# EAGLE schematic Stepper Driver jig bottom (EAGLE 6.6.0)
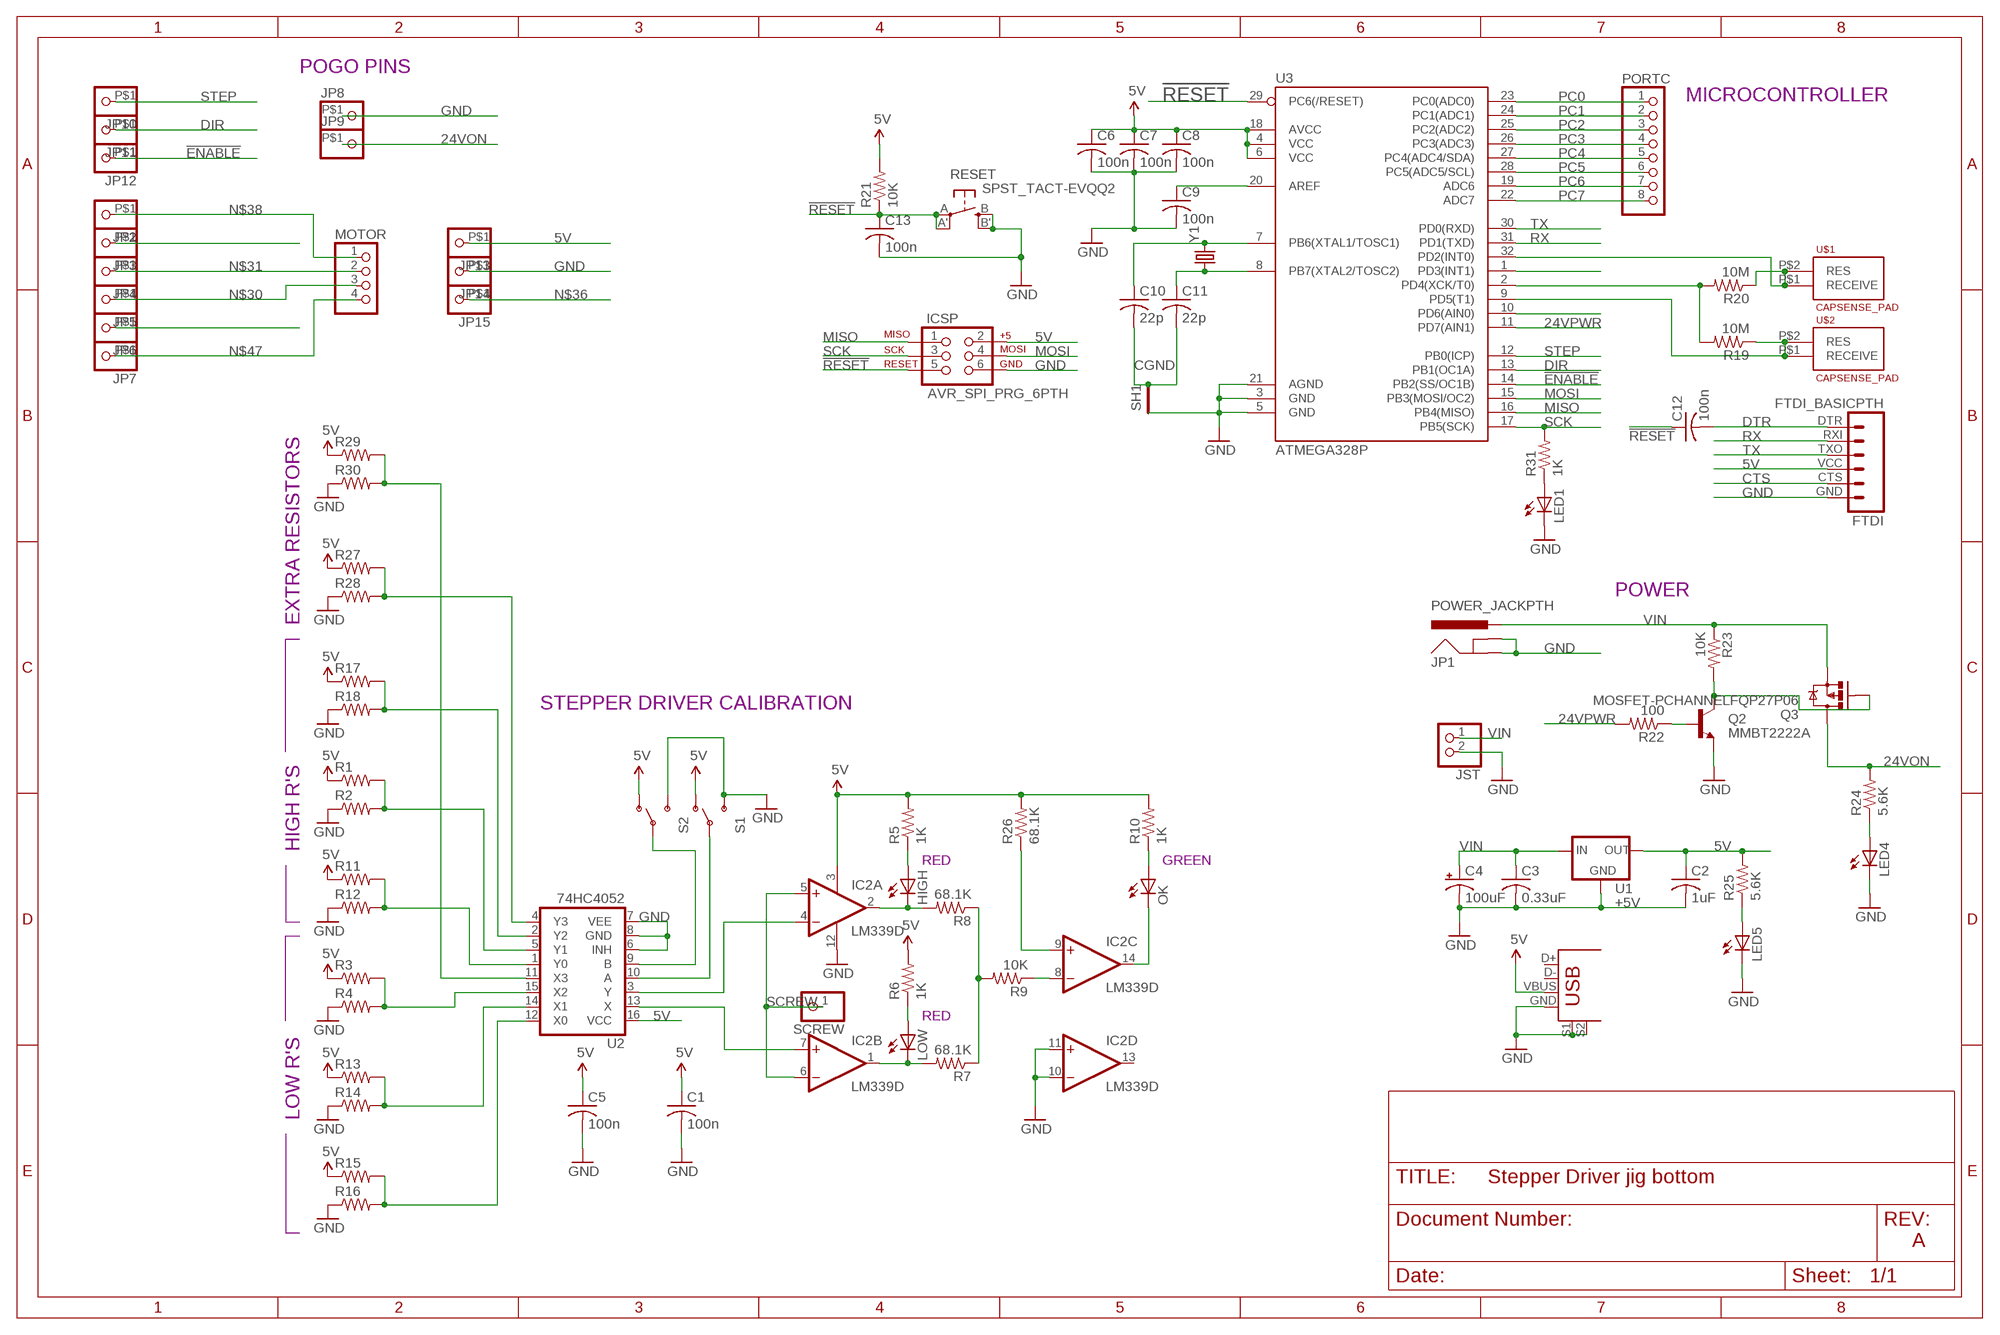
[diagram p0: schematic, sheet 1]

## Parts
C1  100n  C-USC0805  [C0805]
C2  1uF  C-USC0805  [C0805]
C3  0.33uF  C-USC0805  [C0805]
C4  100uF  CPOL-USUD-8X10  [UD-8X10_NICHICON]
C5  100n  C-USC0805  [C0805]
C6  100n  C-USC0805  [C0805]
C7  100n  C-USC0805  [C0805]
C8  100n  C-USC0805  [C0805]
C9  100n  C-USC0805  [C0805]
C10  22p  C-USC0805  [C0805]
C11  22p  C-USC0805  [C0805]
C12  100n  C-USC0805  [C0805]
C13  100n  C-USC0805  [C0805]
FTDI  FTDI_BASICPTH  [FTDI_BASIC]
HIGH  LEDCHIPLED_1206  [CHIPLED_1206]
IC2  LM339D  [SO14]
ICSP  AVR_SPI_PRG_6PTH  [2X3]
JP1  POWER_JACKPTH  [POWER_JACK_PTH]
JP2  PINHD-1X1  [POGOPIN]
JP3  PINHD-1X1  [POGOPIN]
JP4  PINHD-1X1  [POGOPIN]
JP5  PINHD-1X1  [POGOPIN]
JP6  PINHD-1X1  [POGOPIN]
JP7  PINHD-1X1  [POGOPIN]
JP8  PINHD-1X1  [POGOPIN]
JP9  PINHD-1X1  [POGOPIN]
JP10  PINHD-1X1  [POGOPIN]
JP11  PINHD-1X1  [POGOPIN]
JP12  PINHD-1X1  [POGOPIN]
JP13  PINHD-1X1  [POGOPIN]
JP14  PINHD-1X1  [POGOPIN]
JP15  PINHD-1X1  [POGOPIN]
JST  JST_2PIN-SMT-RA  [JST-PH-2-SMT-RA]
LED1  LEDCHIP-LED0805  [CHIP-LED0805]
LED4  LEDCHIPLED_0805  [CHIPLED_0805]
LED5  LEDCHIPLED_0805  [CHIPLED_0805]
LOW  LEDCHIPLED_1206  [CHIPLED_1206]
MOTOR  PINHD-1X4  [1X04]
OK  LEDCHIPLED_1206  [CHIPLED_1206]
PORTC  PINHD-1X8  [1X08]
Q2  MMBT2222A  TRANSISTOR_NPNMMBT2222A  [SOT23-3]
Q3  MOSFET-PCHANNELFQP27P06  [TO220V]
R1  R-US_M0805  [M0805]
R2  R-US_M0805  [M0805]
R3  R-US_M0805  [M0805]
R4  R-US_M0805  [M0805]
R5  1K  R-US_M0805  [M0805]
R6  1K  R-US_M0805  [M0805]
R7  68.1K  R-US_M0805  [M0805]
R8  68.1K  R-US_M0805  [M0805]
R9  10K  R-US_M0805  [M0805]
R10  1K  R-US_M0805  [M0805]
R11  R-US_M0805  [M0805]
R12  R-US_M0805  [M0805]
R13  R-US_M0805  [M0805]
R14  R-US_M0805  [M0805]
R15  R-US_M0805  [M0805]
R16  R-US_M0805  [M0805]
R17  R-US_M0805  [M0805]
R18  R-US_M0805  [M0805]
R19  10M  R-US_M0805  [M0805]
R20  10M  R-US_M0805  [M0805]
R21  10K  R-US_M0805  [M0805]
R22  100  R-US_M0805  [M0805]
R23  10K  R-US_M0805  [M0805]
R24  5.6K  R-US_M0805  [M0805]
R25  5.6K  R-US_M0805  [M0805]
R26  68.1K  R-US_M0805  [M0805]
R27  R-US_M0805  [M0805]
R28  R-US_M0805  [M0805]
R29  R-US_M0805  [M0805]
R30  R-US_M0805  [M0805]
R31  1K  R-US_M0805  [M0805]
RESET  SPST_TACT-EVQQ2  [EVQ-Q2]
S1  SWITCH-SPDTKIT  [SWITCH-SPDT_KIT]
S2  SWITCH-SPDTKIT  [SWITCH-SPDT_KIT]
SCREW  PINHD-1X1  [1X01]
SH1  SHORTT5  [SHORT_TOP-50]
U1  +5V  V_REG_78XX7812  [TO-252]
U2  74HC4052  74HC4052SO  [SO16]
U3  ATMEGA328P  ATMEGA328P_TQFP  [TQFP32-08]
U$1  CAPSENSE_PAD  [CAPSENSE_PAD]
U$2  CAPSENSE_PAD  [CAPSENSE_PAD]
U$3  USB+SHIELD  [USB-B-PTH]
Y1  CRYSTALHC49US  [HC49US]

## Nets
5V: C1.1 C2.1 C5.1 C6.1 C7.1 C8.1 FTDI.VCC IC2.3(P:V+) ICSP.2 JP13.P$1 R1.1 R3.1 R5.2 R6.2 R10.2 R11.1 R13.1 R15.1 R17.1 R21.2 R25.2 R26.2 R27.1 R29.1 S1.1(O) S2.1(O) U1.2(OUT) U2.16(VCC) U3.4(VCC) U3.6(VCC) U3.18(AVCC) U$3.VBUS
24VON: JP9.P$1 Q3.2(D) R24.2
24VPWR: R22.2 U3.11(PD7(AIN1))
!ENABLE: JP12.P$1 U3.14(PB2(SS/OC1B))
!RESET: C12.1 C13.1 ICSP.5 R21.1 RESET.A'(P1) RESET.A(P) U3.29(PC6(/RESET))
CGND: C10.2 C11.2 SH1.2
CTS: FTDI.CTS
DIR: JP11.P$1 U3.13(PB1(OC1A))
DTR: C12.2 FTDI.DTR
GND: C1.2 C2.2 C3.2 C4.- C5.2 C6.2 C7.2 C8.2 C9.2 C13.2 FTDI.GND IC2.10(D:-IN) IC2.11(D:+IN) IC2.12(P:GND) ICSP.6 JP1.GND JP1.GNDBREAK JP8.P$1 JP14.P$1 JST.2 LED1.C LED4.C LED5.C Q2.2(E) R2.1 R4.1 R12.1 R14.1 R16.1 R18.1 R28.1 R30.1 RESET.B'(S1) RESET.B(S) S1.3(S) S2.3(S) SH1.1 U1.3(GND) U2.6(INH) U2.7(VEE) U2.8(GND) U3.3(GND) U3.5(GND) U3.21(AGND) U$3.GND U$3.S1 U$3.S2
MISO: ICSP.1 U3.16(PB4(MISO))
MOSI: ICSP.4 U3.15(PB3(MOSI/OC2))
N$2: IC2.4(A:-IN) U2.3(Y)
N$3: IC2.7(B:+IN) U2.13(X)
N$4: IC2.1(B:OUT) LOW.C R7.2
N$5: LOW.A R6.1
N$6: HIGH.C IC2.2(A:OUT) R8.2
N$7: HIGH.A R5.1
N$8: R7.1 R8.1 R9.2
N$9: IC2.8(C:-IN) R9.1
N$10: OK.A R10.1
N$11: IC2.14(C:OUT) OK.C
N$12: R11.2 R12.2 U2.1(Y0)
N$13: R1.2 R2.2 U2.5(Y1)
N$14: R3.2 R4.2 U2.15(X2)
N$15: R13.2 R14.2 U2.14(X1)
N$16: R15.2 R16.2 U2.12(X0)
N$17: R17.2 R18.2 U2.2(Y2)
N$19: S1.2(P) U2.10(A)
N$20: S2.2(P) U2.9(B)
N$21: R19.1 U3.9(PD5(T1)) U$2.P$1(RECEIVE) U$2.P$2(RES)
N$22: C11.1 U3.8(PB7(XTAL2/TOSC2)) Y1.1
N$23: C9.1 U3.20(AREF)
N$24: C10.1 U3.7(PB6(XTAL1/TOSC1)) Y1.2
N$25: Q2.3(C) Q3.1(G) R23.2
N$26: Q2.1(B) R22.1
N$27: R19.2 R20.2 U3.2(PD4(XCK/T0))
N$29: R20.1 U3.32(PD2(INT0)) U$1.P$1(RECEIVE) U$1.P$2(RES)
N$30: JP5.P$1 MOTOR.3
N$31: JP4.P$1 MOTOR.2
N$32: JP3.P$1
N$33: JP6.P$1
N$36: JP15.P$1
N$38: JP2.P$1 MOTOR.1
N$41: LED4.A R24.1
N$42: LED5.A R25.1
N$45: U3.1(PD3(INT1))
N$46: U3.10(PD6(AIN0))
N$47: JP7.P$1 MOTOR.4
N$48: IC2.9(C:+IN) R26.1
N$49: R27.2 R28.2 U2.4(Y3)
N$50: R29.2 R30.2 U2.11(X3)
N$51: LED1.A R31.1
PC0: PORTC.1 U3.23(PC0(ADC0))
PC1: PORTC.2 U3.24(PC1(ADC1))
PC2: PORTC.3 U3.25(PC2(ADC2))
PC3: PORTC.4 U3.26(PC3(ADC3))
PC4: PORTC.5 U3.27(PC4(ADC4/SDA))
PC5: PORTC.6 U3.28(PC5(ADC5/SCL))
PC6: PORTC.7 U3.19(ADC6)
PC7: PORTC.8 U3.22(ADC7)
RX: FTDI.RXI U3.31(PD1(TXD))
SCK: ICSP.3 R31.2 U3.17(PB5(SCK))
SCREW: IC2.5(A:+IN) IC2.6(B:-IN) SCREW.1
STEP: JP10.P$1 U3.12(PB0(ICP))
TX: FTDI.TXO U3.30(PD0(RXD))
VIN: C3.1 C4.+ JP1.PWR JST.1 Q3.3(S) R23.1 U1.1(IN)
Unconnected: IC2.13(D:OUT) U$3.D+ U$3.D-

## Notes on the sheet
- POGO PINS
- MICROCONTROLLER
- POWER
- EXTRA RESISTORS
- STEPPER DRIVER CALIBRATION
- HIGH R'S
- RED | GREEN
- RED
- LOW R'S
- A

## Library data of the parts
C1-C3 C5-C13 = rcl:C-US: CAPACITOR, American symbol
C4 = rcl:CPOL-US: POLARIZED CAPACITOR, American symbol
FTDI = SparkFun-Connectors:FTDI_BASIC: FTDI Basic header with labels
HIGH LED1 LED4 LED5 LOW OK = adafruit:LED: LED OSRAM: - CHIPLED LG R971, LG N971, LY N971, LG Q971, LY Q971, LO R971, LY R971 LH N974, LH R974 LS Q976, LO Q976, LY Q976 LO Q996 - Hyper CHIPLED LW Q18S LB Q993, LB Q99A, LB R99A - SideLED LS A670, LO A670, LY A670, LG A670, LP A670 LB A673, LV A673, LT A673, LW A673 LH A674 LY A675 LS A676, LA A676, LO A676, LY A676, LW A676 LS A679, LY A679, LG A679 - Hyper Micro SIDELED® LS Y876, LA Y876, LO Y876, LY Y876 LT Y87S - SmartLED LW L88C, LW L88S LB L89C, LB L89S, LG L890 LS L89K, LO L89K, LY L89K LS L896, LA L896, LO L896, LY L896 - TOPLED LS T670, LO T670, LY T670, LG T670, LP T670 LSG T670, LSP T670, LSY T670, LOP T670, LYG T670 LG T671, LOG T671, LSG T671 LB T673, LV T673, LT T673, LW T673 LH T674 LS T676, LA T676, LO T676, LY T676, LB T676, LH T676, LSB T676, LW T676 LB T67C, LV T67C, LT T67C, LS T67K, LO T67K, LY T67K, LW E67C LS E67B, LA E67B, LO E67B, LY E67B, LB E67C, LV E67C, LT E67C LW T67C LS T679, LY T679, LG T679 LS T770, LO T770, LY T770, LG T770, LP T770 LB T773, LV T773, LT T773, LW T773 LH T774 LS E675, LA E675, LY E675, LS T675 LS T776, LA T776, LO T776, LY T776, LB T776 LHGB T686 LT T68C, LB T68C - Hyper Mini TOPLED® LB M676 - Mini TOPLED Santana® LG M470 LS M47K, LO M47K, LY M47K Source: http://www.osram.convergy.de/
IC2 = linear:LM339: Low Power Low Offset Voltage Quad Comparators with open collector; LM139/LM239/LM339/LM2901/LM3302
ICSP = SparkFun-Connectors:AVR_SPI_PRG_6: AVR ISP 6 Pin This is the reduced ISP connector for AVR programming. Common on Arduino. This footprint will take up less PCB space and can be used with a 10-pin to 6-pin adapter such as SKU: BOB-08508 **Special note about "TEST_POINT" package. The stop mask is on the top side, so if you want your programming test points to be on the bottom of your board, make sure to place this package on the bottom side of the board. This also ensure that the orientation to program from the bottom side will be correct.
JP1 = SparkFun-Connectors:POWER_JACK: Power Jack This is the standard 5.5mm barrel jack for power. The PTH is the most common, proven, reliable, footprint. The Slot footprint only works if the mill layer is transmitted to the PCB fab house so be warned. Mating wall wart : TOL-00298 (and others); PROD_ID: CONN-08197
JP2-JP15 = MarcEagleParts:PINHD-1X1: Pin header 1x1 for 0.1" spacing With round pins
JST = adafruit:JST_2PIN: JST 2-Pin Connectors of various flavors SMT-RA (S2B-PH-SM4) 4UConnector #17311 SMT (B2B-PH-SM4) THM-RA (S2B-PH) THM (B2B-PH)
MOTOR = pinhead:PINHD-1X4: PIN HEADER
PORTC = pinhead:PINHD-1X8: PIN HEADER
Q2 = SparkFun-DiscreteSemi:TRANSISTOR_NPN: Generic NPN BJT MMBT2222A - TRANS-08049 (SOT-23, 1A 40V) MPSA42 - TRANS-09116 (SOT-23, 500mA 300V) MMBT5088LT1G - TRANS-11160 (SOT-23, 50 mA 30V) BC547 - COM-08928 <http://www.sparkfun.com/products/8928> (TO-92 45V 100mA) (1.Collector 2.Base 3.Emitter) 2N3904 - COM-00521 <http://www.sparkfun.com/products/521> (TO-92 40V 200mA) (1.Emitter 2.Base 3.Collector) P2N2222A - COM-12852 <http://www.sparkfun.com/products/12852> (TO-92 40V 600mA) (1.Collector 2.Base 3.Emitter); PROD_ID: TRANS-08049
Q3 = SparkFun-DiscreteSemi:MOSFET-PCHANNEL: Generic PMOSFET IRLML2244 - TRANS-11153 (SOT-23 -20V -4.3A) (1.Gate 2.Source 3.Drain) FQP27P06 - COM-10349 <http://www.sparkfun.com/products/10349> (TO-220 -60V -27A) (1.Gate 2.Source 3.Drain)
R1-R31 = adafruit:R-US_: RESISTOR, American symbol
RESET = adafruit:SPST_TACT: SMT 6mm switch, EVQQ2 series http://www.ladyada.net/library/eagle
S1 S2 = SparkFun-Electromechanical:SWITCH-SPDT: SPDT Switch Simple slide switch, Spark Fun Electronics SKU : COM-00102 DPDT SMT slide switch, AYZ0202, SWCH-08179; PROD_ID: SWCH-08261
SCREW = pinhead:PINHD-1X1: PIN HEADER
SH1 = shorts:SHORT: Short between two nets; BOM: no
U1 = SparkFun-PowerIC:V_REG_78XX: Voltage Regulator Standard 78xx regulator. IGO (Input Ground Output). Spark Fun Electronics SKU : COM-00107; PROD_ID: VREG-12370; VALUE: +12v
U2 = SparkFun-AnalogIC:74HC4052: Dual 4:1 analog mux; PROD_ID: IC-09813
U3 = SparkFun-DigitalIC:ATMEGA328P_TQFP; PROD_ID: IC-09069; VALUE: ATMEGA328P_TQFP
U$1 U$2 = SparkFun-Electromechanical:CAPSENSE_PAD: Generic copper pad for a capacitive touch sensor.
U$3 = SparkFun-Connectors:USB+SHIELD: USB+Shield USB connector with shield pins connectable
Y1 = SparkFun-FreqCtrl:CRYSTAL: Various standard crystals. Proven footprints.